# EAGLE schematic main (EAGLE 9.6.2)
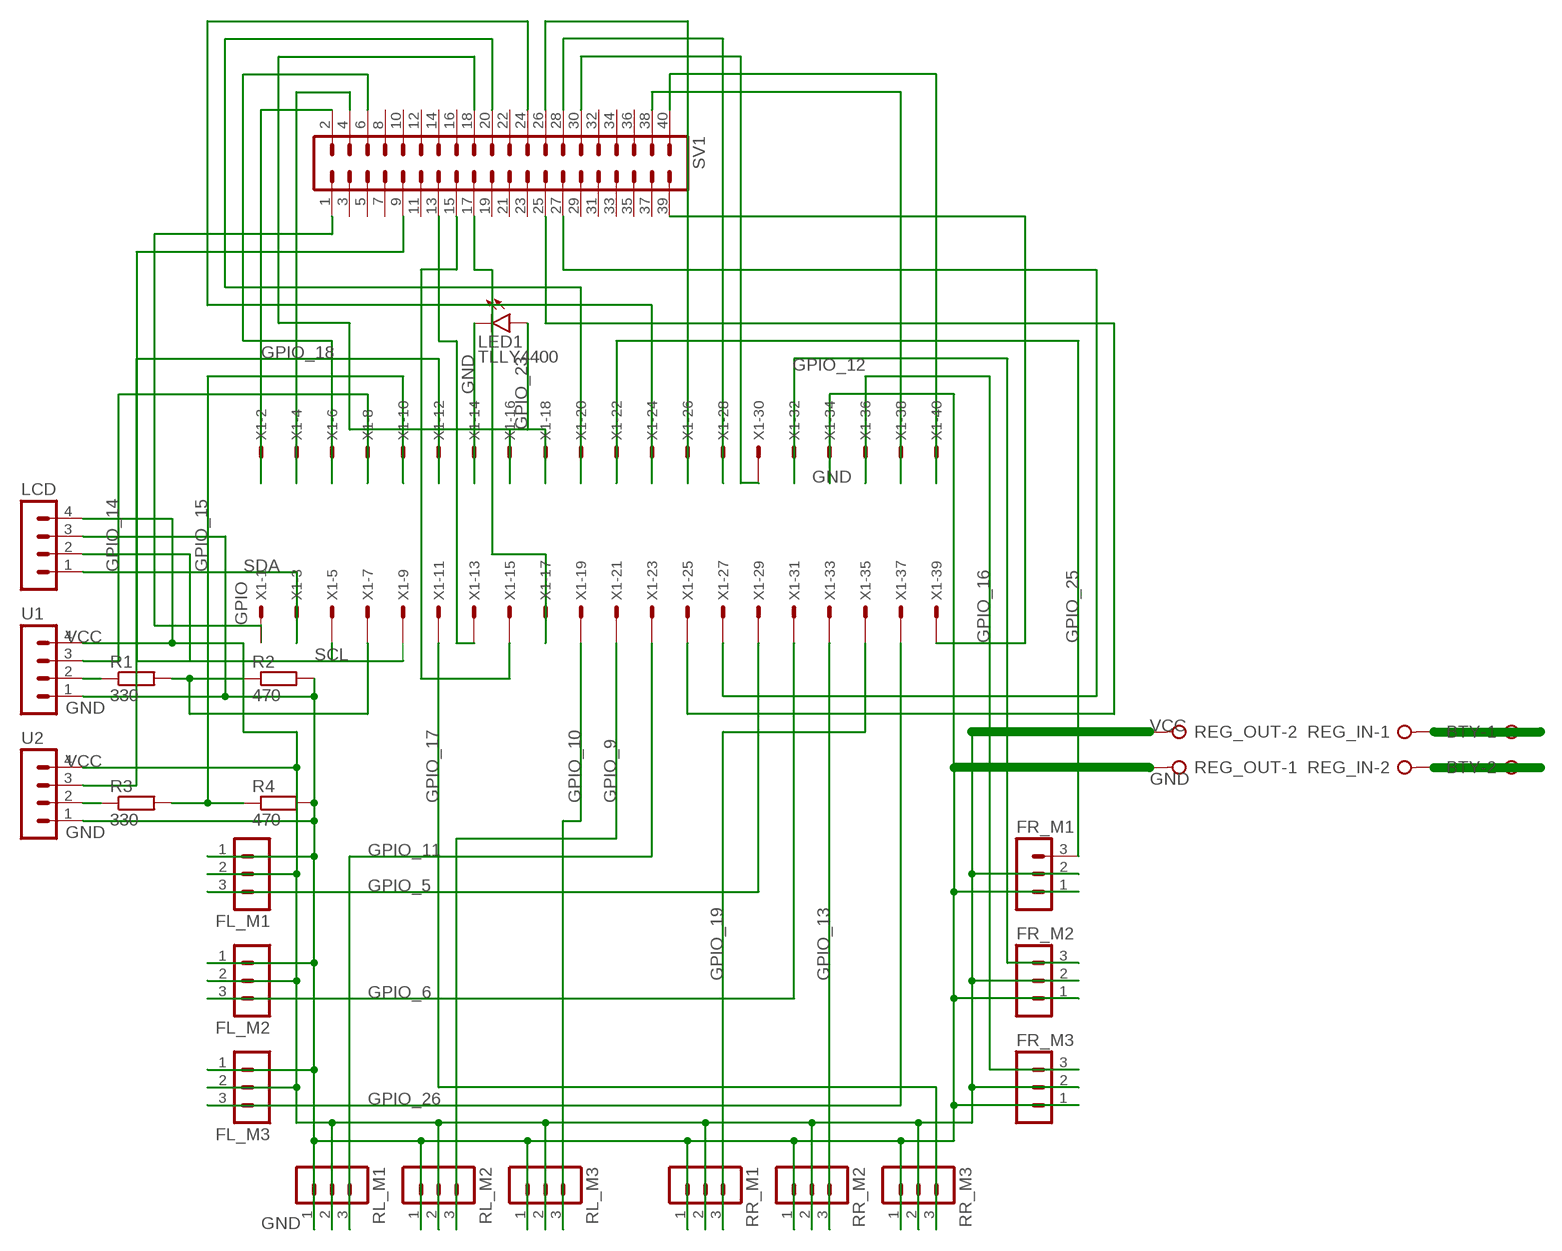
[diagram p0: schematic, sheet 1]

## Parts
BTY  W237-02P  [W237-132]
FL_M1  MA03-1  [MA03-1]
FL_M2  MA03-1  [MA03-1]
FL_M3  MA03-1  [MA03-1]
FR_M1  MA03-1  [MA03-1]
FR_M2  MA03-1  [MA03-1]
FR_M3  MA03-1  [MA03-1]
LCD  MA04-1  [MA04-1]
LED1  TLLY4400  [LED3MM]
R1  330  R-EU_0204/7  [0204/7]
R2  470  R-EU_0204/7  [0204/7]
R3  330  R-EU_0204/7  [0204/7]
R4  470  R-EU_0204/7  [0204/7]
REG_IN  W237-02P  [W237-132]
REG_OUT  W237-02P  [W237-132]
RL_M1  MA03-1  [MA03-1]
RL_M2  MA03-1  [MA03-1]
RL_M3  MA03-1  [MA03-1]
RR_M1  MA03-1  [MA03-1]
RR_M2  MA03-1  [MA03-1]
RR_M3  MA03-1  [MA03-1]
SV1  MA20-2  [MA20-2]
U1  MA04-1  [MA04-1]
U2  MA04-1  [MA04-1]
X1  GPIO  057-040-1  [057-040-1]

## Nets
E1: R1.1 U1.2
GND: FL_M1.1 FL_M2.1 FL_M3.1 FR_M1.1 FR_M2.1 FR_M3.1 LCD.3 LED1.K(C) R2.2 R4.2 REG_OUT.1 RL_M1.1 RL_M2.1 RL_M3.1 RR_M1.1 RR_M2.1 RR_M3.1 U1.1 U2.1 X1.14 X1.34
GPIO_5: FL_M1.3 X1.29
GPIO_6: FL_M2.3 X1.31
GPIO_9: RL_M2.3 X1.21
GPIO_10: RL_M3.3 X1.19
GPIO_11: RL_M1.3 X1.23
GPIO_12: FR_M2.3 X1.32
GPIO_13: RR_M2.3 X1.33
GPIO_14: U1.3 X1.8
GPIO_15: R3.2 R4.1 X1.10
GPIO_16: FR_M3.3 X1.36
GPIO_17: RR_M3.3 X1.11
GPIO_18: U2.3 X1.12
GPIO_19: RR_M1.3 X1.35
GPIO_23: LED1.A X1.16
GPIO_25: FR_M1.3 X1.22
GPIO_26: FL_M3.3 X1.37
N$1: R3.1 U2.2
N$2: R1.2 R2.1 X1.7
N$3: SV1.2 X1.2
N$4: SV1.4 X1.4
N$5: SV1.6 X1.6
N$6: SV1.18 X1.18
N$7: SV1.20 X1.20
N$8: SV1.24 X1.24
N$9: SV1.26 X1.26
N$10: SV1.28 X1.28
N$11: SV1.30 X1.30
N$12: SV1.40 X1.40
N$13: SV1.38 X1.38
N$14: SV1.39 X1.39
N$15: BTY.1 REG_IN.1
N$16: BTY.2 REG_IN.2
N$17: SV1.27 X1.27
N$18: SV1.25 X1.25
N$19: SV1.1 X1.1
N$20: SV1.9 X1.9
N$21: SV1.13 X1.13
N$22: SV1.15 X1.15
N$23: SV1.17 X1.17
SCL: LCD.2 X1.5
SDA: LCD.1 X1.3
VCC: FL_M1.2 FL_M2.2 FL_M3.2 FR_M1.2 FR_M2.2 FR_M3.2 LCD.4 REG_OUT.2 RL_M1.2 RL_M2.2 RL_M3.2 RR_M1.2 RR_M2.2 RR_M3.2 U1.4 U2.4
Unconnected: SV1.3 SV1.5 SV1.7 SV1.8 SV1.10 SV1.11 SV1.12 SV1.14 SV1.16 SV1.19 SV1.21 SV1.22 SV1.23 SV1.29 SV1.31 SV1.32 SV1.33 SV1.34 SV1.35 SV1.36 SV1.37

## Library data of the parts
BTY REG_IN REG_OUT = con-wago-508:W237-02P: WAGO SREW CLAMP; OC_FARNELL: unknown; OC_NEWARK: unknown
FL_M1-FL_M3 FR_M1-FR_M3 RL_M1-RL_M3 RR_M1-RR_M3 = con-lstb:MA03-1: PIN HEADER; OC_FARNELL: unknown; OC_NEWARK: unknown
LCD U1 U2 = con-lstb:MA04-1: PIN HEADER; OC_FARNELL: unknown; OC_NEWARK: unknown
LED1 = led:TLLY4400: Low Current (2mA) LED 3 mm Tinted Diffused Package color YELLOW Source: Data sheet <http://www.farnell.com/datasheets/391098.pdf>; MF: VISHAY SEMICONDUCTOR; OC_FARNELL: 1612439
R1-R4 = rcl:R-EU_: RESISTOR, European symbol; SPICEPREFIX: R
SV1 = con-lstb:MA20-2: PIN HEADER; OC_FARNELL: unknown; OC_NEWARK: unknown
X1 = con-panduit:057-040-: CONNECTOR 40-pin series 057 contact pc board low profile headers; OC_FARNELL: unknown; OC_NEWARK: unknown